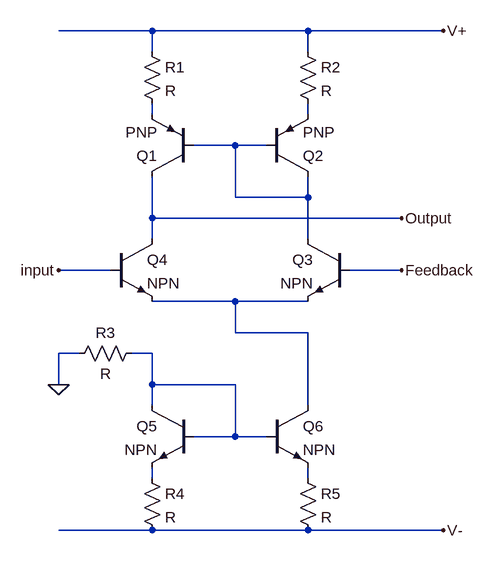
[diagram p0: schematic input_stage_with_current_mirror.asc]
input_stage_with_current_mirror.asc, the LTspice schematic file:
Version 4
SHEET 1 880 700
WIRE -64 -128 -208 -128
WIRE 176 -128 -64 -128
WIRE 384 -128 176 -128
WIRE -64 -96 -64 -128
WIRE 176 -96 176 -128
WIRE -64 0 -64 -16
WIRE 176 0 176 -16
WIRE 64 48 0 48
WIRE 112 48 64 48
WIRE 64 128 64 48
WIRE 176 128 176 96
WIRE 176 128 64 128
WIRE -64 160 -64 96
WIRE 320 160 -64 160
WIRE -64 192 -64 160
WIRE 176 192 176 128
WIRE -128 240 -208 240
WIRE 320 240 240 240
WIRE 64 288 -64 288
WIRE 176 288 64 288
WIRE 64 336 64 288
WIRE 176 336 64 336
WIRE -176 368 -208 368
WIRE -64 368 -96 368
WIRE -208 416 -208 368
WIRE -64 416 -64 368
WIRE 64 416 -64 416
WIRE -64 448 -64 416
WIRE 176 448 176 336
WIRE 64 496 64 416
WIRE 64 496 0 496
WIRE 112 496 64 496
WIRE -64 560 -64 544
WIRE 176 560 176 544
WIRE -64 640 -208 640
WIRE 176 640 -64 640
WIRE 384 640 176 640
FLAG -208 416 0
FLAG 384 -128 V+
FLAG -208 240 input
FLAG 320 240 Feedback
FLAG 384 640 V-
FLAG 320 160 Output
SYMBOL pnp 0 96 R180
SYMATTR InstName Q1
SYMBOL pnp 112 96 M180
SYMATTR InstName Q2
SYMBOL npn 240 192 M0
SYMATTR InstName Q3
SYMBOL npn -128 192 R0
SYMATTR InstName Q4
SYMBOL res -80 -112 R0
SYMATTR InstName R1
SYMBOL res 160 -112 R0
SYMATTR InstName R2
SYMBOL npn 0 448 M0
SYMATTR InstName Q5
SYMBOL npn 112 448 R0
SYMATTR InstName Q6
SYMBOL res -80 352 R90
WINDOW 0 0 56 VBottom 2
WINDOW 3 32 56 VTop 2
SYMATTR InstName R3
SYMBOL res -80 544 R0
SYMATTR InstName R4
SYMBOL res 160 544 R0
SYMATTR InstName R5

The netlist it stands for:
* input_stage_with_current_mirror.asc
Q1 Output N003 N001 0 PNP
Q2 N003 N003 N002 0 PNP
Q3 N003 Feedback N004 0 NPN
Q4 Output input N004 0 NPN
R1 V+ N001 R
R2 V+ N002 R
Q5 N005 N005 N006 0 NPN
Q6 N004 N005 N007 0 NPN
R3 N005 0 R
R4 N006 V- R
R5 N007 V- R
.model NPN NPN
.model PNP PNP
.lib standard.bjt
.backanno
.end